# EAGLE design W102J (EAGLE 6.6.0)
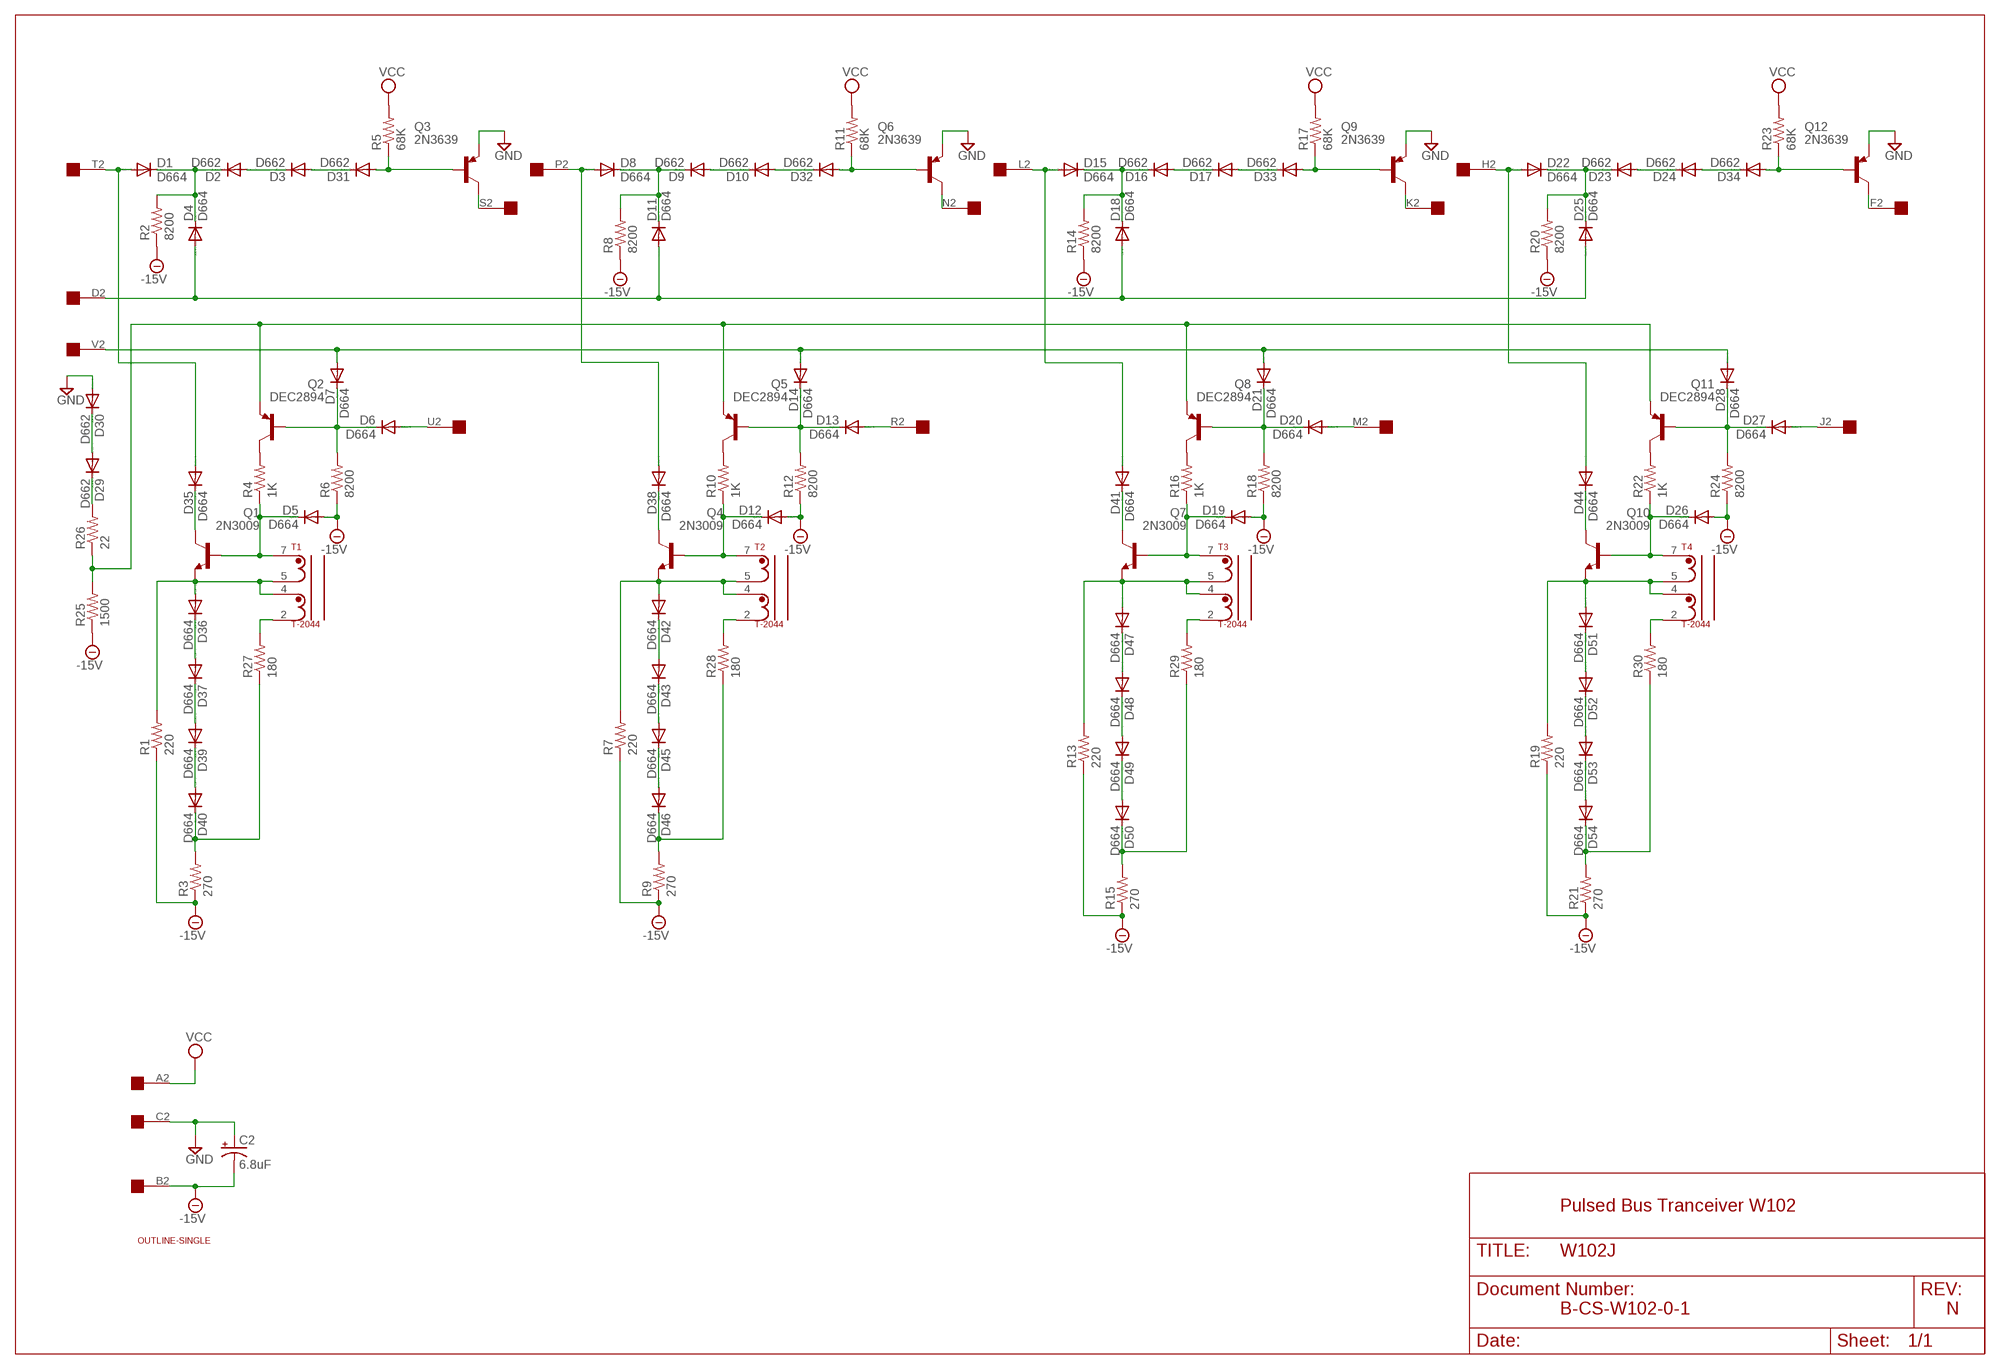
[diagram p0: schematic, sheet 1]

## Parts
C2  6.8uF  CPOL-USE15-5AXIAL  [E15-5]
D1  D664  DIODE-DO35-10  [DO35-10]
D2  D662  DIODE-DO35-10  [DO35-10]
D3  D662  DIODE-DO35-10  [DO35-10]
D4  D664  DIODE-DO35-10  [DO35-10]
D5  D664  DIODE-DO35-10  [DO35-10]
D6  D664  DIODE-DO35-10  [DO35-10]
D7  D664  DIODE-DO35-10  [DO35-10]
D8  D664  DIODE-DO35-10  [DO35-10]
D9  D662  DIODE-DO35-10  [DO35-10]
D10  D662  DIODE-DO35-10  [DO35-10]
D11  D664  DIODE-DO35-10  [DO35-10]
D12  D664  DIODE-DO35-10  [DO35-10]
D13  D664  DIODE-DO35-10  [DO35-10]
D14  D664  DIODE-DO35-10  [DO35-10]
D15  D664  DIODE-DO35-10  [DO35-10]
D16  D662  DIODE-DO35-10  [DO35-10]
D17  D662  DIODE-DO35-10  [DO35-10]
D18  D664  DIODE-DO35-10  [DO35-10]
D19  D664  DIODE-DO35-10  [DO35-10]
D20  D664  DIODE-DO35-10  [DO35-10]
D21  D664  DIODE-DO35-10  [DO35-10]
D22  D664  DIODE-DO35-10  [DO35-10]
D23  D662  DIODE-DO35-10  [DO35-10]
D24  D662  DIODE-DO35-10  [DO35-10]
D25  D664  DIODE-DO35-10  [DO35-10]
D26  D664  DIODE-DO35-10  [DO35-10]
D27  D664  DIODE-DO35-10  [DO35-10]
D28  D664  DIODE-DO35-10  [DO35-10]
D29  D662  DIODE-DO35-10  [DO35-10]
D30  D662  DIODE-DO35-10  [DO35-10]
D31  D662  DIODE-DO35-10  [DO35-10]
D32  D662  DIODE-DO35-10  [DO35-10]
D33  D662  DIODE-DO35-10  [DO35-10]
D34  D662  DIODE-DO35-10  [DO35-10]
D35  D664  DIODE-DO35-10  [DO35-10]
D36  D664  DIODE-DO35-10  [DO35-10]
D37  D664  DIODE-DO35-10  [DO35-10]
D38  D664  DIODE-DO35-10  [DO35-10]
D39  D664  DIODE-DO35-10  [DO35-10]
D40  D664  DIODE-DO35-10  [DO35-10]
D41  D664  DIODE-DO35-10  [DO35-10]
D42  D664  DIODE-DO35-10  [DO35-10]
D43  D664  DIODE-DO35-10  [DO35-10]
D44  D664  DIODE-DO35-10  [DO35-10]
D45  D664  DIODE-DO35-10  [DO35-10]
D46  D664  DIODE-DO35-10  [DO35-10]
D47  D664  DIODE-DO35-10  [DO35-10]
D48  D664  DIODE-DO35-10  [DO35-10]
D49  D664  DIODE-DO35-10  [DO35-10]
D50  D664  DIODE-DO35-10  [DO35-10]
D51  D664  DIODE-DO35-10  [DO35-10]
D52  D664  DIODE-DO35-10  [DO35-10]
D53  D664  DIODE-DO35-10  [DO35-10]
D54  D664  DIODE-DO35-10  [DO35-10]
Q1  2N3009  -NPN-TO5  [TO5]
Q2  DEC2894  -PNP-TO5  [TO5]
Q3  2N3639  -PNP-TO5  [TO5]
Q4  2N3009  -NPN-TO5  [TO5]
Q5  DEC2894  -PNP-TO5  [TO5]
Q6  2N3639  -PNP-TO5  [TO5]
Q7  2N3009  -NPN-TO5  [TO5]
Q8  DEC2894  -PNP-TO5  [TO5]
Q9  2N3639  -PNP-TO5  [TO5]
Q10  2N3009  -NPN-TO5  [TO5]
Q11  DEC2894  -PNP-TO5  [TO5]
Q12  2N3639  -PNP-TO5  [TO5]
R1  220  R-US_0207/10  [0207/10]
R2  8200  R-US_0207/10  [0207/10]
R3  270  R-US_0207/10  [0207/10]
R4  1K  R-US_0207/10  [0207/10]
R5  68K  R-US_0207/10  [0207/10]
R6  8200  R-US_0207/10  [0207/10]
R7  220  R-US_0207/10  [0207/10]
R8  8200  R-US_0207/10  [0207/10]
R9  270  R-US_0207/10  [0207/10]
R10  1K  R-US_0207/10  [0207/10]
R11  68K  R-US_0207/10  [0207/10]
R12  8200  R-US_0207/10  [0207/10]
R13  220  R-US_0207/10  [0207/10]
R14  8200  R-US_0207/10  [0207/10]
R15  270  R-US_0207/10  [0207/10]
R16  1K  R-US_0207/10  [0207/10]
R17  68K  R-US_0207/10  [0207/10]
R18  8200  R-US_0207/10  [0207/10]
R19  220  R-US_0207/10  [0207/10]
R20  8200  R-US_0207/10  [0207/10]
R21  270  R-US_0207/10  [0207/10]
R22  1K  R-US_0207/10  [0207/10]
R23  68K  R-US_0207/10  [0207/10]
R24  8200  R-US_0207/10  [0207/10]
R25  1500  R-US_0207/10  [0207/10]
R26  22  R-US_0207/10  [0207/10]
R27  180  R-US_0207/10  [0207/10]
R28  180  R-US_0207/10  [0207/10]
R29  180  R-US_0207/10  [0207/10]
R30  180  R-US_0207/10  [0207/10]
T1  T-2044  [TRANSFORMER]
T2  T-2044  [TRANSFORMER]
T3  T-2044  [TRANSFORMER]
T4  T-2044  [TRANSFORMER]
U$1  OUTLINE-SINGLE  [SINGLE]
U$2  EDGE-1  [EDGE-CON1]

## Nets
-15V: C2.- D5.A D12.A D19.A D26.A R1.1 R2.1 R3.1 R6.1 R7.1 R8.1 R9.1 R12.1 R13.1 R14.1 R15.1 R18.1 R19.1 R20.1 R21.1 R24.1 R25.1 U$2.B2
D2: D4.A D11.A D18.A D25.A U$2.D2
F2: Q12.3(C) U$2.F2
GND: C2.+ D30.A Q3.1(E) Q6.1(E) Q9.1(E) Q12.1(E) U$2.C2
H2: D22.A D44.A U$2.H2
J2: D27.A U$2.J2
K2: Q9.3(C) U$2.K2
L2: D15.A D41.A U$2.L2
M2: D20.A U$2.M2
N2: Q6.3(C) U$2.N2
N$1: D1.C D2.C D4.C R2.2
N$2: D2.A D3.C
N$3: D3.A D31.C
N$4: D6.C D7.C Q2.2(B) R6.2
N$5: D8.C D9.C D11.C R8.2
N$6: D9.A D10.C
N$7: D10.A D32.C
N$8: D13.C D14.C Q5.2(B) R12.2
N$9: D15.C D16.C D18.C R14.2
N$10: D16.A D17.C
N$11: D17.A D33.C
N$12: D20.C D21.C Q8.2(B) R18.2
N$13: D22.C D23.C D25.C R20.2
N$14: D23.A D24.C
N$15: D24.A D34.C
N$16: D27.C D28.C Q11.2(B) R24.2
N$17: D5.C Q1.2(B) R4.1 T1.7
N$18: D12.C Q4.2(B) R10.1 T2.7
N$19: D19.C Q7.2(B) R16.1 T3.7
N$20: D26.C Q10.2(B) R22.1 T4.7
N$21: Q2.3(C) R4.2
N$23: Q8.3(C) R16.2
N$25: D36.A Q1.1(E) R1.2 T1.4 T1.5
N$26: D42.A Q4.1(E) R7.2 T2.4 T2.5
N$27: D47.A Q7.1(E) R13.2 T3.4 T3.5
N$28: D51.A Q10.1(E) R19.2 T4.4 T4.5
N$29: D35.C Q1.3(C)
N$30: D39.C D40.A
N$31: D37.C D39.A
N$32: D36.C D37.A
N$33: R27.2 T1.2
N$34: D40.C R3.2 R27.1
N$35: D31.A Q3.2(B) R5.1
N$36: D42.C D43.A
N$37: D38.C Q4.3(C)
N$38: D43.C D45.A
N$39: D32.A Q6.2(B) R11.1
N$40: D33.A Q9.2(B) R17.1
N$41: D34.A Q12.2(B) R23.1
N$42: D45.C D46.A
N$43: Q2.1(E) Q5.1(E) Q8.1(E) Q11.1(E) R25.2 R26.1
N$44: D29.C R26.2
N$45: D29.A D30.C
N$46: Q11.3(C) R22.2
N$47: Q5.3(C) R10.2
N$48: R28.2 T2.2
N$49: D41.C Q7.3(C)
N$50: D47.C D48.A
N$51: D48.C D49.A
N$52: D49.C D50.A
N$53: R29.2 T3.2
N$54: D46.C R9.2 R28.1
N$55: D44.C Q10.3(C)
N$56: D53.C D54.A
N$57: D50.C R15.2 R29.1
N$58: D52.C D53.A
N$59: D51.C D52.A
N$60: R30.2 T4.2
N$61: D54.C R21.2 R30.1
P2: D8.A D38.A U$2.P2
R2: D13.A U$2.R2
S2: Q3.3(C) U$2.S2
T2: D1.A D35.A U$2.T2
U2: D6.A U$2.U2
V2: D7.A D14.A D21.A D28.A U$2.V2
VCC: R5.2 R11.2 R17.2 R23.2 U$2.A2
Unconnected: U$2.E2

## Notes on the sheet
- Pulsed Bus Tranceiver W102
- B-CS-W102-0-1 | N

## Library data of the parts
C2 = dec-con:CPOL-USE15-5AXIAL: 0.6" veresion of an electrolytic
D1-D54 = diode:DIODE-: DIODE
Q1 Q4 Q7 Q10 = transistor:*-NPN-: NPN Transistror BF959 corrected 2008.03.06
Q2 Q3 Q5 Q6 Q8 Q9 Q11 Q12 = transistor:*-PNP-: PNP Transistror
R1-R30 = rcl:R-US_: RESISTOR, American symbol
T1-T4 = dec-con:T-2044: T-2044 Transformer
U$1 = dec-con:OUTLINE-*: Board outlines for DEC boards.
U$2 = dec-con:EDGE-1: Single-Sided DEC Edge Connector -- (side 2)

## Net classes
0 default: width 0.813 mm

## Board
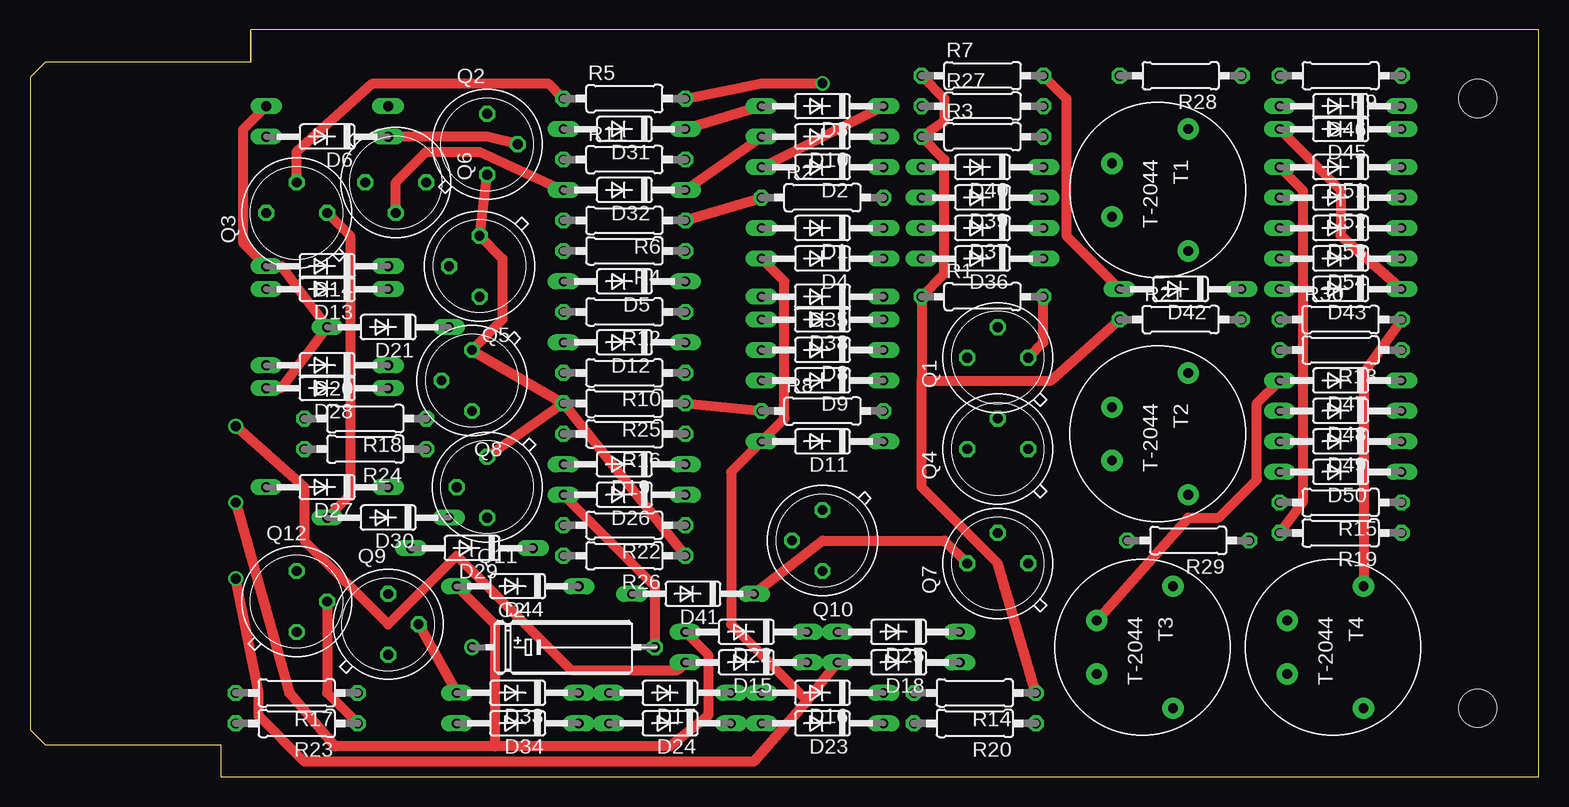
[diagram p1: board, top side]
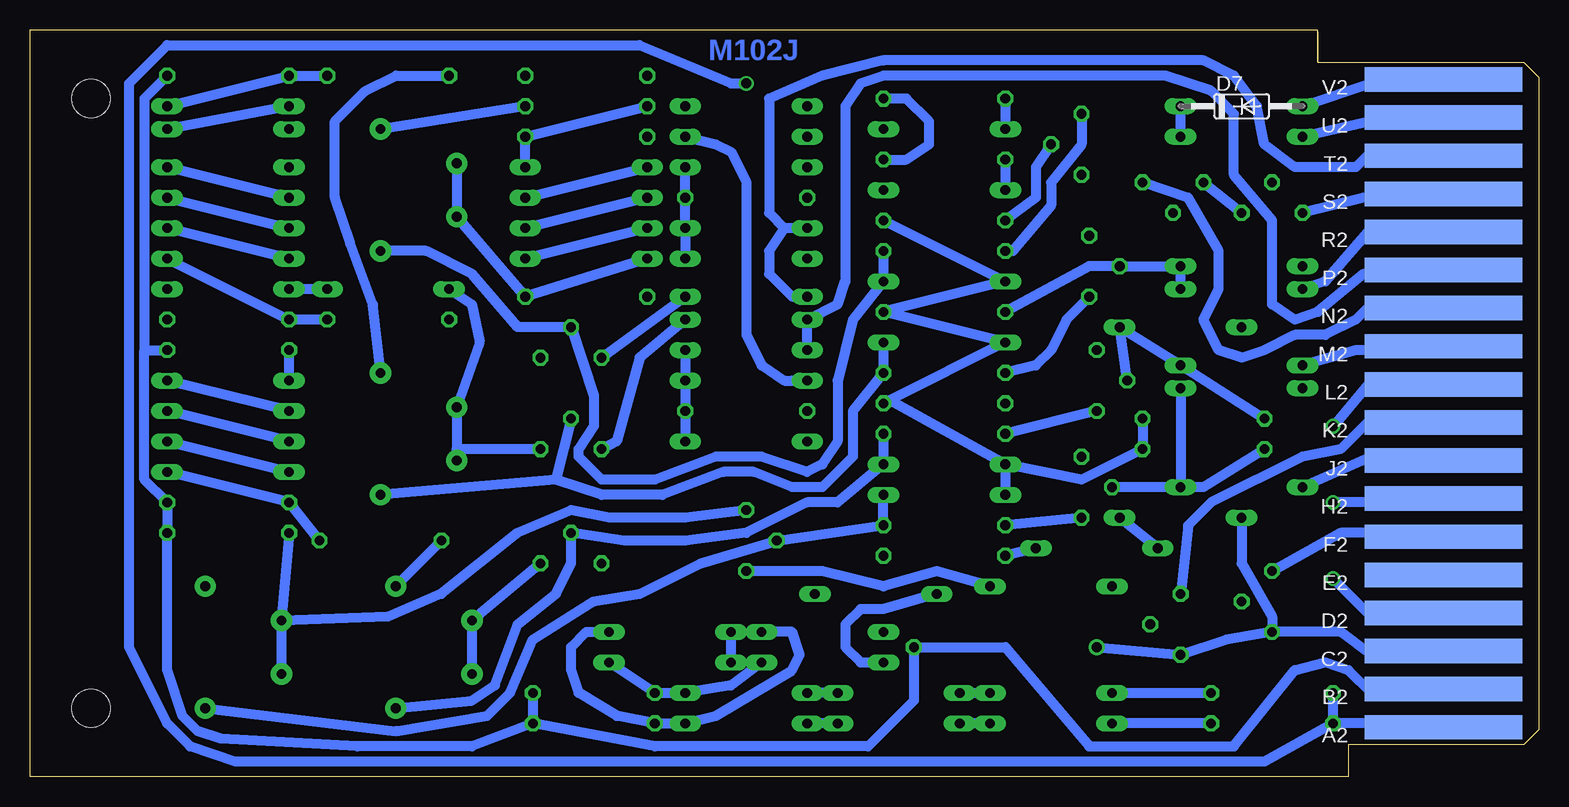
[diagram p2: board, bottom side, seen from below]

Size 125.73 x 62.23 mm. Coordinates in mm from the lower left corner, seen from the top.
Copper layers (1+16): Top 0.035mm / dielectric 1.5mm / Bottom 0.035mm
Design rules "16mils": minimum track width 16mil, minimum drill 32mil, track to track 15mil, track to pad 10mil, pad to pad 10mil, via to via 10mil, smd to smd 10mil, copper to edge 13mil, drill to drill 10mil, minimum pad ring 10mil, minimum via ring 8mil, stop-mask expansion 0mil, vias tented up to drill 0mil, thermal gap 10mil

### Footprints (pad centres in the part's own frame; a part is rotated, then mirrored left to right if it is on the bottom)
E15-5 = drill 0.813: + -7.62,0 | drill 0.813 octagon: - 7.62,0
DO35-10 = drill 0.813 long: A 5.08,0; C -5.08,0
TO5 = drill 0.813 octagon: 1 0,-2.54; 2 2.54,0; 3 0,2.54
0207/10 = drill 0.813 octagon: 1 -5.08,0; 2 5.08,0
TRANSFORMER = drill 0.813 pad 1.778: 2 -5.08,2.54; 4 -2.223,-3.81; 5 2.223,-3.81; 7 5.08,2.54
SINGLE = hole 3.175: 120.65,56.515; 120.65,5.715
EDGE-CON1 = smd 13.106 x 2.032 bottom: A2 7.938,4.128; B2 7.938,7.303; C2 7.938,10.477; D2 7.938,13.652; E2 7.938,16.828; F2 7.938,20.003; H2 7.938,23.177; J2 7.938,26.352; K2 7.938,29.527; L2 7.938,32.703; M2 7.938,35.877; N2 7.938,39.053; P2 7.938,42.227; R2 7.938,45.403; S2 7.938,48.578; T2 7.938,51.752; U2 7.938,54.928; V2 7.938,58.102

### Placement (x,y rotation side)
C2  44.45,10.79 0 top
D1  66.04,45.72 180 top
D2  66.04,50.8 180 top
D3  66.04,55.88 180 top
D4  66.04,43.18 180 top
D5  49.53,41.27 180 top
D6  24.77,53.34 180 top
D7  24.77,55.88 0 bottom
D8  66.04,35.56 180 top
D9  66.04,33.02 180 top
D10  66.04,53.34 180 top
D11  66.04,27.94 180 top
D12  49.53,36.2 180 top
D13  24.77,40.64 180 top
D14  24.77,42.55 180 top
D15  59.69,9.53 180 top
D16  66.04,6.99 180 top
D17  53.34,6.99 180 top
D18  72.39,9.53 180 top
D19  49.53,26.04 180 top
D20  24.77,34.29 180 top
D21  29.85,37.47 180 top
D22  59.69,12.06 180 top
D23  66.04,4.45 180 top
D24  53.34,4.45 180 top
D25  72.39,12.06 180 top
D26  49.53,23.5 180 top
D27  24.77,24.13 180 top
D28  24.77,32.38 180 top
D29  36.83,19.05 180 top
D30  29.85,21.59 180 top
D31  49.53,53.98 180 top
D32  49.53,48.9 180 top
D33  40.64,6.99 180 top
D34  40.64,4.45 180 top
D35  66.04,40.01 180 top
D36  79.38,43.18 180 top
D37  79.38,45.72 180 top
D38  66.04,38.1 180 top
D39  79.38,48.26 180 top
D40  79.38,50.8 180 top
D41  55.25,15.24 180 top
D42  95.89,40.64 180 top
D43  109.22,40.64 180 top
D44  40.64,15.88 180 top
D45  109.22,53.98 180 top
D46  109.22,55.88 180 top
D47  109.22,33.02 180 top
D48  109.22,30.48 180 top
D49  109.22,27.94 180 top
D50  109.22,25.4 180 top
D51  109.22,50.8 180 top
D52  109.22,48.26 180 top
D53  109.22,45.72 180 top
D54  109.22,43.18 180 top
Q1  80.65,34.92 90 top
Q2  38.1,52.7 0 top
Q3  22.23,46.99 90 top
Q4  80.65,27.3 90 top
Q5  37.47,42.55 180 top
Q6  30.48,49.53 270 top
Q7  80.65,17.78 90 top
Q8  36.83,33.02 180 top
Q9  29.85,12.7 0 top
Q10  66.04,19.68 180 top
Q11  38.1,24.13 180 top
Q12  22.23,14.61 0 top
R1  79.38,40.01 0 top
R2  66.04,48.26 0 top
R3  79.38,53.34 0 top
R4  49.53,43.81 180 top
R5  49.53,56.52 0 top
R6  49.53,46.35 180 top
R7  79.38,58.42 0 top
R8  66.04,30.48 0 top
R9  109.22,58.42 180 top
R10  49.53,33.66 180 top
R11  49.53,51.44 0 top
R12  49.53,38.73 180 top
R13  109.22,35.56 180 top
R14  78.74,6.99 180 top
R15  109.22,22.86 180 top
R16  49.53,28.57 180 top
R17  22.23,6.99 180 top
R18  27.94,29.84 180 top
R19  109.22,20.32 180 top
R20  78.74,4.45 180 top
R21  95.89,38.1 0 top
R22  49.53,20.95 180 top
R23  22.23,4.45 180 top
R24  27.94,27.3 180 top
R25  49.53,31.11 180 top
R26  49.53,18.41 180 top
R27  79.38,55.88 0 top
R28  95.89,58.42 180 top
R29  96.52,19.68 180 top
R30  109.22,38.1 0 top
T1  93.98,48.9 270 top
T2  93.98,28.57 270 top
T3  92.71,10.79 270 top
T4  108.59,10.79 270 top
U$1  0,0 0 top
U$2  0,0 0 top

### Tracks (layer width: path | path; a pad name or v marks a point on that pad's centre or on a via)
-15V
  Top 0.813: R25.1 R8.1 | R7.1 76.2,56.52 76.2,54.61 R3.1 76.2,51.44 76.2,41.91 R1.1 74.3,33.02 | 74.3,33.02 85.09,33.02 R21.1 | R6.1 R2.1 | D26.A 52.07,15.88 C2.- | R14.1 80.65,17.78 74.3,24.13 74.3,33.02
  Bottom 0.813: U$2.B2 8.26,6.99 13.97,6.99 15.88,8.89 17.78,9.53 20.32,8.89 25.4,2.54 37.47,2.54 44.45,10.79 C2.- 52.07,6.35 55.88,2.54 73.66,2.54 R20.1 | R14.1 R20.1 | R20.1 88.9,2.54 98.43,2.54 109.86,3.17 111.76,3.81 113.03,5.08 114.3,8.89 R19.1 R15.1 116.21,24.77 116.21,35.56 | R6.1 D5.A R12.1 D12.A 54.1,31.37 | 54.1,31.37 R25.1 | R18.1 R24.1 38.1,24.77 D19.A | D19.A 54.1,31.37 | D19.A D26.A | 116.21,35.56 R13.1 | R9.1 116.21,56.52 116.21,35.56
D2  (via drill 0.81)
  Top 0.813: 64.77,6.35 58.42,12.7 58.42,25.4 D11.A 62.87,29.84 62.87,41.27 D4.A | 64.77,6.35 D18.A | 64.77,6.35 60.33,1.27 22.86,1.27 19.05,5.08 19.05,6.99 v17.15,16.51
  Bottom 0.813: U$2.D2 10.16,13.34 13.97,13.34 v17.15,16.51 | D18.A D25.A
F2
  Bottom 0.813: U$2.F2 8.89,20.32 16.51,20.32 Q12.3
GND
  Top 0.813: Q3.1 26.67,45.09 26.67,23.5 D30.A
  Bottom 0.813: Q6.1 Q3.1 | U$2.C2 8.89,10.16 13.97,10.16 16.51,12.06 Q12.1 | Q12.1 26.04,11.43 Q9.1 C2.+ | D30.A 24.77,17.78 22.23,13.34 Q12.1
H2  (via drill 0.81)
  Top 0.813: D22.A 56.52,10.16 56.52,5.08 53.34,2.54 38.74,2.54 | 38.74,2.54 25.4,2.54 21.59,6.99 v17.15,22.86 | D44.A 38.74,12.7 38.74,2.54
  Bottom 0.813: U$2.H2 8.89,22.86 v17.15,22.86
J2
  Bottom 0.813: U$2.J2 8.89,26.67 13.97,26.67 D27.A
K2
  Bottom 0.813: U$2.K2 8.26,29.84 13.97,29.84 16.51,27.3 19.69,26.67 27.31,22.86 29.21,20.95 Q9.3
L2  (via drill 0.81)
  Top 0.813: v17.15,29.21 22.86,24.13 22.86,19.68 29.85,12.7 35.56,18.41 45.09,8.89 53.98,8.89 D15.A
  Bottom 0.813: U$2.L2 8.89,33.02 13.97,33.02 v17.15,29.21 | D41.A 54.61,13.97 56.52,13.97 57.79,12.7 57.79,10.79 56.52,9.53 D15.A
M2
  Bottom 0.813: U$2.M2 9.53,35.56 15.24,35.56 D20.A
N2
  Bottom 0.813: U$2.N2 8.89,39.37 13.97,39.37 15.24,38.1 17.78,36.83 20.32,36.83 22.86,35.56 24.77,34.92 26.67,35.56 27.94,38.1 26.67,40.64 26.67,43.81 29.21,48.26 Q6.3
N$1
  Bottom 0.813: D4.C D1.C R2.2 D2.C
N$2
  Top 0.813: D2.A D3.C
N$3
  Top 0.813: D3.A D31.C
N$4
  Top 0.813: Q2.2 38.1,53.34 D6.C
  Bottom 0.813: D6.C D7.C | Q2.2 41.91,50.8 41.91,48.26 R6.2
N$5
  Bottom 0.813: D8.C D9.C R8.2 D11.C
N$6
  Bottom 0.813: D10.C 68.58,52.7 67.31,52.07 66.04,49.53 66.04,36.83 64.77,34.29 62.87,33.02 62.23,33.02 D9.A
N$7
  Top 0.813: D32.C D10.A
N$8
  Bottom 0.813: D13.C D14.C Q5.2 37.47,42.55 R12.2
N$9
  Bottom 0.813: D18.C R14.2 D16.C 67.31,7.62 D15.C
N$10
  Bottom 0.813: D17.C D16.A
N$11
  Bottom 0.813: D17.A D33.C
N$12
  Bottom 0.813: R18.2 D20.C D21.C Q8.2
N$13
  Bottom 0.813: D22.C 62.23,12.06 61.6,10.16 62.23,8.89 68.58,5.08 D23.C R20.2 76.84,5.08 80.01,6.99 80.65,8.89 80.65,10.79 79.38,12.06 D25.C
N$14
  Bottom 0.813: D24.C D23.A
N$15
  Bottom 0.813: D34.C D24.A
N$16
  Bottom 0.813: D27.C Q11.2 | D28.C D27.C | R24.2 27.94,24.13 D27.C
N$17
  Bottom 0.813: T1.7 92.71,43.81 88.9,41.91 85.09,37.47 Q1.2 78.74,31.75 78.74,29.21 80.01,27.3 80.01,26.67 78.11,24.77 73.66,24.77 68.58,26.67 64.77,26.67 60.96,25.4 59.69,26.04 58.42,27.94 58.42,33.02 57.15,38.1 D5.C R4.1
N$18
  Bottom 0.813: D12.C R10.1 57.15,30.48 57.15,26.67 59.69,24.13 62.23,24.13 65.41,25.4 67.95,25.4 73.03,23.5 78.11,23.5 81.92,24.77 | 81.92,24.77 T2.7 | Q4.2 81.92,24.77
N$19
  Bottom 0.813: R16.1 D19.C 58.42,22.86 60.96,22.86 66.04,20.32 71.12,19.68 76.2,19.68 Q7.2 80.65,17.78 81.92,15.24 85.09,12.7 87,7.62 88.9,6.35 T3.7
N$20
  Bottom 0.813: D26.C R22.1 Q10.2 69.85,17.78 74.93,15.24 78.74,14.61 83.82,11.43 85.73,6.99 87.63,5.08 95.25,3.81 T4.7
N$21
  Bottom 0.813: Q2.3 38.1,52.7 40.64,49.53 40.64,47.62 43.82,43.81 R4.2
N$23
  Bottom 0.813: Q8.3 R16.2
N$25
  Top 0.813: Q1.1 84.46,36.2 R1.2
  Bottom 0.813: T1.4 T1.5 R1.2 D36.A
N$26
  Top 0.813: R7.2 86.36,56.52 86.36,45.09 D42.A
  Bottom 0.813: Q4.1 90.17,27.3 | 90.17,27.3 T2.5 | 90.17,27.3 T2.4 88.27,36.2 88.9,39.37 D42.A
N$27
  Top 0.813: T3.4 96.52,21.59 99.06,21.59 102.24,24.77 102.24,31.11 D47.A
  Bottom 0.813: T3.5 T3.4 Q7.1 | D47.A R13.2
N$28
  Top 0.813: D51.A 106.05,48.9 106.05,22.86 R19.2
  Bottom 0.813: T4.4 T4.5 | Q10.1 71.12,21.59 77.47,21.59 80.65,22.23 85.09,20.32 91.44,15.24 95.89,13.34 T4.4 | R19.2 T4.4
N$29
  Bottom 0.813: D35.C Q1.3
N$30
  Bottom 0.813: D39.C D40.A
N$31
  Bottom 0.813: D39.A D37.C
N$32
  Bottom 0.813: D37.A D36.C
N$33
  Bottom 0.813: R27.2 T1.2
N$34
  Bottom 0.813: D40.C R3.2 R27.1
N$35
  Top 0.813: Q3.2 22.23,52.07 28.58,57.78 43.18,57.78 R5.1
  Bottom 0.813: R5.1 D31.A
N$36
  Bottom 0.813: D42.C D43.A
N$37
  Bottom 0.813: D38.C 74.93,34.92 76.84,27.94 Q4.3
N$38
  Top 0.813: D45.A 109.22,48.9 109.22,45.09 D43.C
N$39
  Top 0.813: Q6.2 30.48,49.53 33.02,52.07 37.47,52.07 D32.A
  Bottom 0.813: R11.1 D32.A
N$40
  Top 0.813: Q9.2 D33.A
  Bottom 0.813: D33.A R17.1
N$41
  Top 0.813: Q12.2 24.77,6.99 R23.1
  Bottom 0.813: R23.1 D34.A
N$42
  Bottom 0.813: D46.A D45.C
N$43
  Top 0.813: Q2.1 Q5.1 39.37,43.18 39.37,38.1 Q8.1 R25.2 | R25.2 Q11.1 | R25.2 R26.1
N$44
  Bottom 0.813: D29.C R26.2
N$45
  Bottom 0.813: D29.A D30.C
N$46
  Bottom 0.813: Q11.3 R22.2
N$47
  Bottom 0.813: Q5.3 39.37,38.1 40.64,35.56 41.91,34.29 R10.2
N$48
  Bottom 0.813: T2.2 97.16,39.37 99.06,44.45 100.33,48.26 100.33,54.61 97.79,57.15 95.25,58.42 R28.2
N$49
  Top 0.813: D41.C 66.04,19.68 76.2,19.68 Q7.3
N$50
  Bottom 0.813: D48.A D47.C
N$51
  Bottom 0.813: D49.A D48.C
N$52
  Bottom 0.813: D49.C D50.A
N$53
  Bottom 0.813: R29.2 T3.2
N$54
  Bottom 0.813: R28.1 R9.2 D46.C
N$55
  Bottom 0.813: D44.C 50.17,17.14 54.61,15.88 59.69,17.14 Q10.3
N$56
  Bottom 0.813: D54.A D53.C
N$57
  Bottom 0.813: R29.1 R15.2 D50.C
N$58
  Bottom 0.813: D52.C D53.A
N$59
  Bottom 0.813: D52.A D51.C
N$60
  Top 0.813: R30.2 111.13,33.66 T4.2
N$61
  Bottom 0.813: R21.2 R30.1 D54.C
P2
  Bottom 0.813: U$2.P2 8.89,41.91 14.61,41.91 18.42,38.73 20.32,38.1 22.23,39.37 22.23,46.35 25.4,50.16 25.4,55.24 27.31,57.15 31.12,58.42 54.61,58.42 56.52,57.78 57.79,55.88 57.79,41.27 58.42,39.37 D38.A D8.A
R2
  Bottom 0.813: U$2.R2 8.89,45.72 13.97,45.72 17.78,41.27 D13.A
S2
  Bottom 0.813: U$2.S2 8.89,48.26 14.61,48.26 Q3.3
T2
  Bottom 0.813: U$2.T2 10.16,51.75 10.16,52.07 13.97,52.07 15.24,50.8 20.32,50.8 22.86,52.7 23.5,55.88 25.4,58.42 27.94,59.69 54.61,59.69 59.69,58.42 64.14,56.52 64.14,46.99 62.87,45.72 | D1.A 62.87,45.72 | 62.87,45.72 64.14,43.81 64.14,41.91 62.23,40.01 D35.A
U2
  Bottom 0.813: U$2.U2 8.89,54.61 13.97,54.61 D6.A
V2
  Top 0.813: D7.A 17.78,53.98 17.78,44.45 D14.A 20.96,42.55 D21.A 20.96,32.38 D28.A
  Bottom 0.813: U$2.V2 9.53,57.78 13.97,57.78 D7.A
VCC  (via drill 0.81)
  Top 0.813: R5.2 60.96,57.78 v66.04,57.78
  Bottom 0.813: U$2.A2 8.89,4.45 R23.2 | R23.2 R17.2 | R11.2 52.71,51.44 50.8,52.7 50.8,54.61 52.71,56.52 R5.2 | R23.2 22.86,1.27 108.59,1.27 112.4,2.54 114.3,4.45 117.48,10.79 117.48,57.78 114.3,60.96 74.93,60.96 67.31,57.78 v66.04,57.78

### Text on the board
Bottom: M102J
200bmp: C:/Users/Vince/Documents/eagle/projects/DEC/Wxxx/W102/W102Jbackfb.bmp